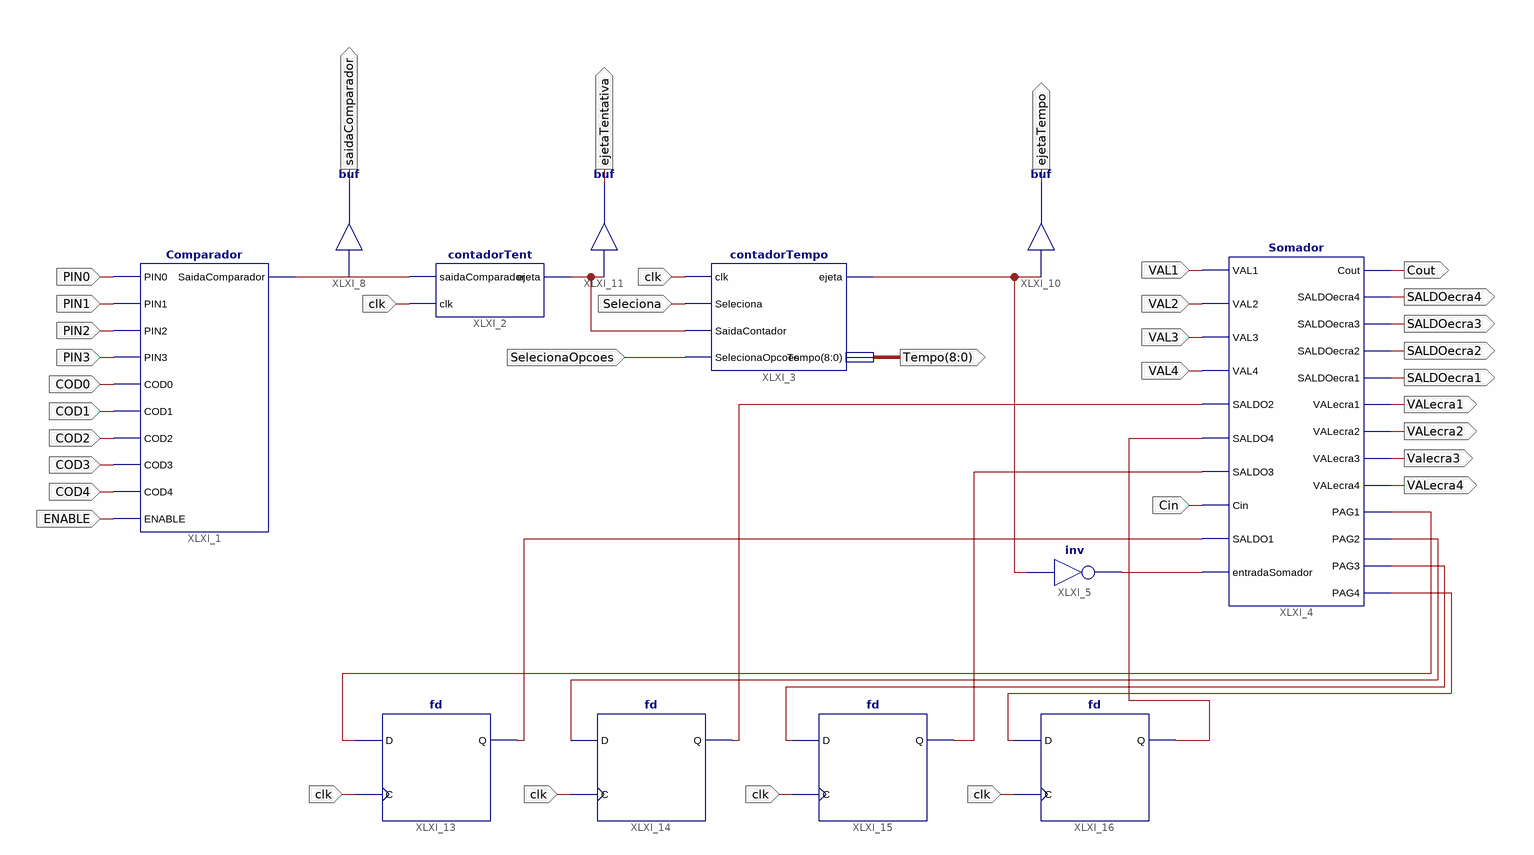
[diagram p0: schematic sheet 1]
// Xilinx ISE schematic EsquemaFinal.sch (spartan3e) as structural Verilog: 12 symbols, 31 ports
module EsquemaFinal (
  input  PIN0,
  input  PIN1,
  input  PIN2,
  input  PIN3,
  input  COD0,
  input  COD1,
  input  COD2,
  input  COD3,
  input  COD4,
  input  ENABLE,
  input  clk,
  input  Seleciona,
  input  SelecionaOpcoes,
  input  VAL1,
  input  VAL2,
  input  VAL3,
  input  VAL4,
  input  Cin,
  output Cout,
  output SALDOecra4,
  output SALDOecra3,
  output SALDOecra2,
  output SALDOecra1,
  output VALecra1,
  output VALecra2,
  output Valecra3,
  output VALecra4,
  output [8:0] Tempo,
  output saidaComparador,
  output ejetaTentativa,
  output ejetaTempo
);

  wire XLXN_36, XLXN_37, XLXN_41, XLXN_43, XLXN_52, XLXN_53, XLXN_57, XLXN_58, XLXN_59, XLXN_60, XLXN_61,
       XLXN_62;

  Comparador XLXI_1 (
    .PIN0(PIN0), .PIN1(PIN1), .PIN2(PIN2), .PIN3(PIN3), .COD0(COD0), .COD1(COD1), .COD2(COD2), .COD3(COD3),
    .COD4(COD4), .ENABLE(ENABLE), .SaidaComparador(XLXN_37));
  contadorTent XLXI_2 (.saidaComparador(XLXN_37), .clk(clk), .ejeta(XLXN_41));
  contadorTempo XLXI_3 (
    .clk(clk), .Seleciona(Seleciona), .SaidaContador(XLXN_41), .SelecionaOpcoes(SelecionaOpcoes),
    .ejeta(XLXN_43), .Tempo(Tempo));
  Somador XLXI_4 (
    .VAL1(VAL1), .VAL2(VAL2), .VAL3(VAL3), .VAL4(VAL4), .SALDO2(XLXN_60), .SALDO4(XLXN_62), .SALDO3(XLXN_61),
    .Cin(Cin), .SALDO1(XLXN_59), .entradaSomador(XLXN_36), .Cout(Cout), .SALDOecra4(SALDOecra4),
    .SALDOecra3(SALDOecra3), .SALDOecra2(SALDOecra2), .SALDOecra1(SALDOecra1), .VALecra1(VALecra1),
    .VALecra2(VALecra2), .VALecra3(Valecra3), .VALecra4(VALecra4), .PAG1(XLXN_52), .PAG2(XLXN_53),
    .PAG3(XLXN_57), .PAG4(XLXN_58));
  not XLXI_5 (XLXN_36, XLXN_43);
  buf XLXI_8 (saidaComparador, XLXN_37);
  buf XLXI_10 (ejetaTempo, XLXN_43);
  buf XLXI_11 (ejetaTentativa, XLXN_41);
  fd XLXI_13 (.C(clk), .D(XLXN_52), .Q(XLXN_59));
  fd XLXI_14 (.C(clk), .D(XLXN_53), .Q(XLXN_60));
  fd XLXI_15 (.C(clk), .D(XLXN_57), .Q(XLXN_61));
  fd XLXI_16 (.C(clk), .D(XLXN_58), .Q(XLXN_62));
endmodule
